# EasyEDA Pro project ProPrj_USB Connector_2025-08-25.epro

# Schematic Schematic1
Board Name: Board1; Create Date: 2025-08-16; Page Name: P1; Project Name: USB Connector; Schematic Name: Schematic1; Update Date: 2025-08-16; Company: EasyEDA.com; Page Size: A4; Version: V1.0
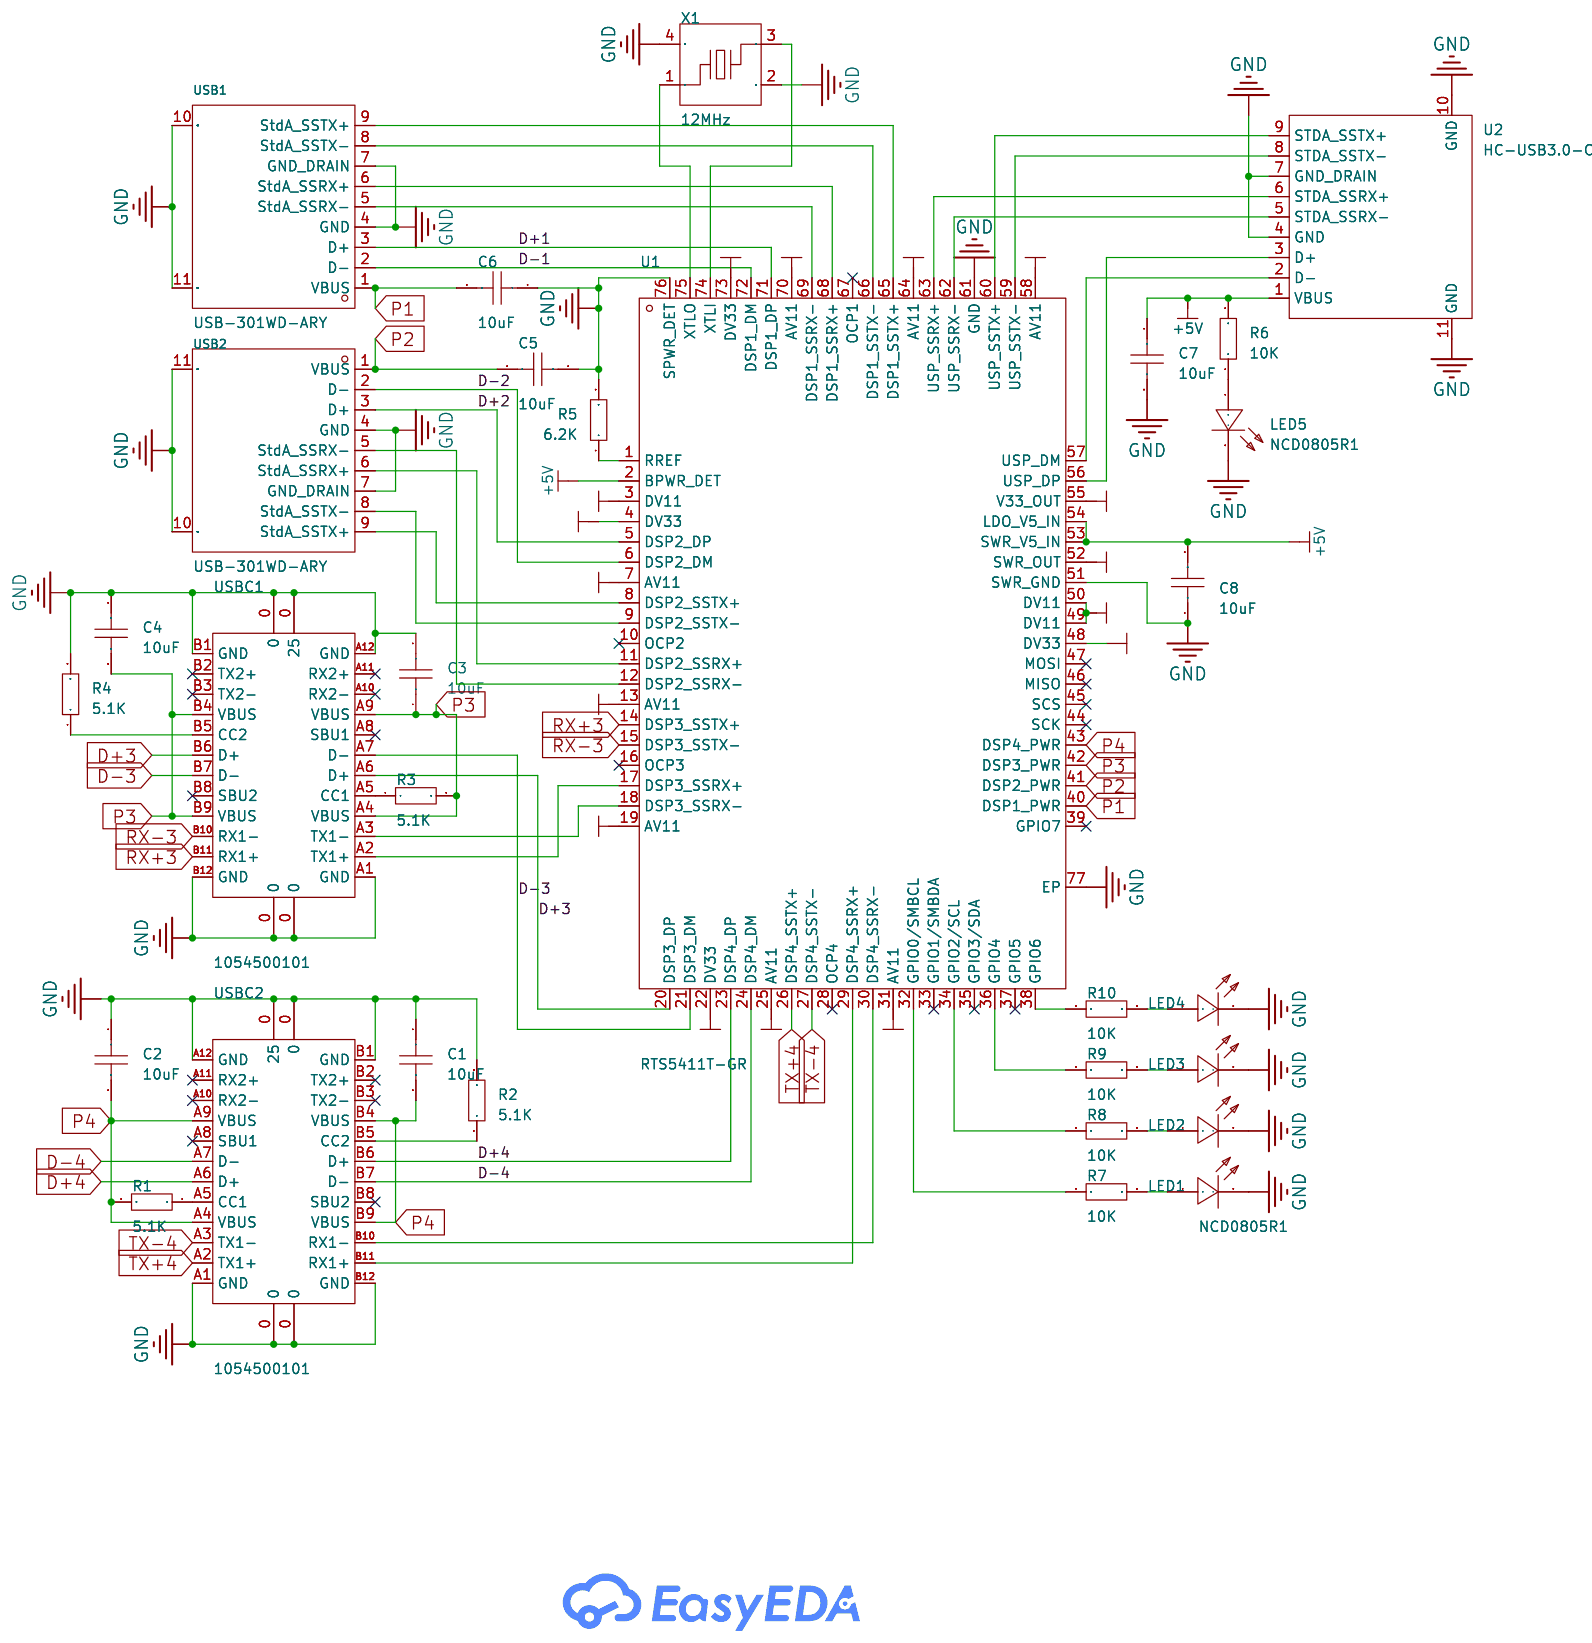
[diagram p0: schematic sheet]

## Parts
C1  10uF  [C0603]
C2  10uF  [C0603]
C3  10uF  [C0603]
C4  10uF  [C0603]
C5  10uF  [C0603]
C6  10uF  [C0603]
C7  10uF  [C0603]
C8  10uF  [C0603]
LED1  NCD0805R1  [LED0805-R-RD]
LED2  NCD0805R1  [LED0805-R-RD]
LED3  NCD0805R1  [LED0805-R-RD]
LED4  NCD0805R1  [LED0805-R-RD]
LED5  NCD0805R1  [LED0805-R-RD]
R1  5.1K  [R0603]
R2  5.1K  [R0603]
R3  5.1K  [R0603]
R4  5.1K  [R0603]
R5  6.2K  [R0603]
R6  10K  [R0603]
R7  10K  [R0603]
R8  10K  [R0603]
R9  10K  [R0603]
R10  10K  [R0603]
U1  RTS5411T-GR  [QFN-76_L9.0-W9.0-P0.40-BL-EP5.4]
U2  HC-USB3.0-C26  [USB-3.0-A-SMD_HC-USB3.0-C26]
USB1  USB-301WD-ARY  [USB-TH_XUNPU_USB-301WD-ARY]
USB2  USB-301WD-ARY  [USB-TH_XUNPU_USB-301WD-ARY]
USBC1  1054500101  [USB-C-SMD_TYPE-C-USB-18]
USBC2  1054500101  [USB-C-SMD_TYPE-C-USB-18]
X1  12MHz  [CRYSTAL-SMD_4P-L3.2-W2.5-BL-1]

## Library data of the parts
C1-C8 = CAP_0603: Supplier Footprint: 0603
LED1-LED5 = NCD0805R1_C84256: Lamp Holder Type:- Emitted Color:Red Forward Voltage (VF):1.6V~2.6V Forward Voltage (VF):1.6V~2.6V Power Dissipation:65mW Forward Current:20mA Dominant Wavelength:615nm~630nm Dominant Wavelength:615nm~630nm Peak Wavelength:- Diode Configuration:独立二极管 Lens; Supplier Part: C84256; Manufacturer: 国星光电; Supplier Footprint: 0805; JLCPCB Part Class: Basic Part; Datasheet: https://atta.szlcsc.com/upload/public/pdf/source/20200820/C84256_F0A75A43B3EAD75808600A0514C76B99.pdf; Supplier: LCSC; Emitted Color: Red; Forward Voltage (VF): 1.6V~2.6V; Power Dissipation: 65mW; Forward Current: 20mA; Dominant Wavelength: 615nm~630nm; Diode Configuration: 独立二极管; Lens Color: 无色透明透镜; Luminous Intensity: 67mcd~195mcd; Viewing Angle: 130°; Operating Temperature: -30℃~+85℃
R1-R10 = Res_0603: Supplier Footprint: 0603
U1 = RTS5411T-GR: type:Hub USB Protocol:USB 3.2 Voltage - Supply:3.3V；1.1V Voltage - Supply:3.3V；1.1V Operating Temperature:0℃~+70℃ Operating Temperature:0℃~+70℃; LCSC Part Name: RTS5411T USB3.2 Gen1x1 超高速 USB 集线器控制器; Supplier Part: C5159024; Manufacturer: REALTEK(瑞昱); Supplier Footprint: QFN-76(9x9); JLCPCB Part Class: Extended Part; Datasheet: https://atta.szlcsc.com/upload/public/pdf/source/20240319/5D12B3C0D31F8AE4B5F4A601072DAD0E.pdf; Supplier: LCSC; type: Hub; USB Protocol: USB 3.2; Voltage - Supply: 3.3V；1.1V; Operating Temperature: 0℃~+70℃
U2 = HC-USB3.0-C26: Connector Type:Type-A Protocol Standard:USB 3.0 Gender:Male Mounting Type:Sink panel Number of Contacts:9P Number of Ports:1 Current Rating-Power:1.5A Voltage Rating:30V Connect-Disconnect Life:1,500 times Supplementary Features:- Center Height:- Length:1; LCSC Part Name: Type-A 公 沉板 USB3.0 A公沉板2.6 直脚中针蓝色 无柱; Supplier Part: C7501854; Manufacturer: HC(虹成电子); Supplier Footprint: SMD; JLCPCB Part Class: Extended Part; Datasheet: https://atta.szlcsc.com/upload/public/pdf/source/20250106/ED41B030890D143B0E8E397973BB91FB.pdf; Supplier: LCSC; Connector Type: Type-A; Protocol Standard: USB 3.0; Gender: Male; Mounting Type: Sink panel; Number of Contacts: 9P; Number of Ports: 1; Current Rating-Power: 1.5A; Voltage Rating: 30V; Connect-Disconnect Life: 1,500 times; Length: 18.9mm; Detection color: Blue; Operating Temperature: -25℃~+70℃
USB1 USB2 = USB-301WD-ARY: Connector Type:Type-A Standard:USB 3.0 Gender:Female Number of Ports:1 Number of Contacts:9P Mounting Style:Right-Angle Current Rating - Power (Max):1.8A Contact Material:- Contact Plating:- Operating Temperature Range:-55℃~+85℃ Operating Temperature Rang; LCSC Part Name: Type-A 母 弯插; Supplier Part: C2895025; Manufacturer: XUNPU(讯普); Supplier Footprint: 插件; JLCPCB Part Class: Extended Part; Datasheet: https://atta.szlcsc.com/upload/public/pdf/source/20210908/6BA804621BB79CD49F2A1A281A5A9824.pdf; Supplier: LCSC; Connector Type: Type-A; Standard: USB 3.0; Gender: Female; Number of Ports: 1; Number of Contacts: 9P; Mounting Style: Right-Angle; Current Rating - Power (Max): 1.8A; Operating Temperature Range: -55℃~+85℃; Soldering Temperature(Max): 260℃
USBC1 USBC2 = 1054500101: Connector Type:Type-C Protocol Standard:USB 3.2 Gender:Female Number of Contacts:24P Number of Ports:1 Current Rating-Power:- Operating Temperature:-30℃~+85℃ Operating Temperature:-30℃~+85℃; LCSC Part Name: Type-C 母; Supplier Part: C134092; Manufacturer: MOLEX; Supplier Footprint: SMD; JLCPCB Part Class: Extended Part; Datasheet: https://www.molex.com/content/dam/molex/molex-dot-com/products/automated/en-us/salesdrawingpdf/105/105450/1054500101_sd.pdf?inline\; Supplier: LCSC; Connector Type: Type-C; Protocol Standard: USB 3.2; Gender: Female; Number of Contacts: 24P; Number of Ports: 1; Operating Temperature: -30℃~+85℃
X1 = XL2EL89COI-111YLC-12M: Type:Crystal Oscillator Frequency:12MHz Normal temperature Frequency Tolerance:±10ppm Normal temperature Frequency Tolerance:±10ppm Load Capacitance:12pF Frequency Stability:±20ppm Frequency Stability:±20ppm Operating Temperature:-40℃~+85℃ Operating Tempe; LCSC Part Name: YSX321SL 12MHZ 4P 3225 12PF ±10PPM -40~85℃ (±20PPM); Supplier Part: C5280578; Manufacturer: YXC(扬兴晶振); Supplier Footprint: SMD3225-4P; JLCPCB Part Class: Extended Part; Datasheet: https://item.szlcsc.com/datasheet/XL2EL89COI-111YLC-12M/6016760.html; Supplier: LCSC; Type: Crystal Oscillator; Normal temperature Frequency Tolerance: ±10ppm; Load Capacitance: 12pF; Frequency Stability: ±20ppm; Operating Temperature: -40℃~+85℃

## Nets
+1V1: U1.3(DV11) U1.7(AV11) U1.13(AV11) U1.19(AV11) U1.25(AV11) U1.31(AV11) U1.49(DV11) U1.50(DV11) U1.52(SWR_OUT) U1.58(AV11) U1.64(AV11) U1.70(AV11)
+3V3: U1.4(DV33) U1.22(DV33) U1.48(DV33) U1.55(V33_OUT) U1.73(DV33)
+5V: C7.1 C8.2 R6.2 U1.2(BPWR_DET) U1.53(SWR_V5_IN) U1.54(LDO_V5_IN) U2.1(VBUS)
GND: C1.1 C2.1 C3.2 C4.1 C5.1 C6.1 C7.2 C8.1 LED1.2(-) LED2.2(-) LED3.2(-) LED4.2(-) LED5.2(-) R2.2 R4.2 R5.2 U1.51(SWR_GND) U1.61(GND) U1.76(SPWR_DET) U1.77(EP) U2.4(GND) U2.7(GND_DRAIN) U2.10(GND) U2.11(GND) USB1.4(GND) USB1.7(GND_DRAIN) USB1.10(SHIELD) USB1.11(SHIELD) USB2.4(GND) USB2.7(GND_DRAIN) USB2.10(SHIELD) USB2.11(SHIELD) USBC1.0 USBC1.A1(GND) USBC1.A12(GND) USBC1.B1(GND) USBC1.B12(GND) USBC2.0 USBC2.A1(GND) USBC2.A12(GND) USBC2.B1(GND) USBC2.B12(GND) X1.2(GND) X1.4(GND)
D+1: U1.71(DSP1_DP) USB1.3(D+)
D+2: U1.5(DSP2_DP) USB2.3(D+)
D+3: U1.20(DSP3_DP) USBC1.A6(D+) USBC1.B6(D+)
D+4: U1.23(DSP4_DP) USBC2.A6(D+) USBC2.B6(D+)
D-1: U1.72(DSP1_DM) USB1.2(D-)
D-2: U1.6(DSP2_DM) USB2.2(D-)
D-3: U1.21(DSP3_DM) USBC1.A7(D-) USBC1.B7(D-)
D-4: U1.24(DSP4_DM) USBC2.A7(D-) USBC2.B7(D-)
P1: C6.2 U1.40(DSP1_PWR) USB1.1(VBUS)
P2: C5.2 U1.41(DSP2_PWR) USB2.1(VBUS)
P3: C3.1 C4.2 R3.2 U1.42(DSP3_PWR) USBC1.A4(VBUS) USBC1.A9(VBUS) USBC1.B4(VBUS) USBC1.B9(VBUS)
P4: C1.2 C2.2 R1.2 U1.43(DSP4_PWR) USBC2.A4(VBUS) USBC2.A9(VBUS) USBC2.B4(VBUS) USBC2.B9(VBUS)
RX+3: U1.14(DSP3_SSTX+) USBC1.B11(RX1+)
RX-3: U1.15(DSP3_SSTX-) USBC1.B10(RX1-)
TX+4: U1.26(DSP4_SSTX+) USBC2.A2(TX1+)
TX-4: U1.27(DSP4_SSTX-) USBC2.A3(TX1-)
$1N3590: U1.12(DSP2_SSRX-) USB2.5(StdA_SSRX-)
$1N3596: U1.11(DSP2_SSRX+) USB2.6(StdA_SSRX+)
$1N3603: U1.8(DSP2_SSTX+) USB2.9(StdA_SSTX+)
$1N3610: U1.9(DSP2_SSTX-) USB2.8(StdA_SSTX-)
$1N3617: U1.65(DSP1_SSTX+) USB1.9(StdA_SSTX+)
$1N3622: U1.66(DSP1_SSTX-) USB1.8(StdA_SSTX-)
$1N3628: U1.69(DSP1_SSRX-) USB1.5(StdA_SSRX-)
$1N3637: U1.68(DSP1_SSRX+) USB1.6(StdA_SSRX+)
$1N3848: U1.29(DSP4_SSRX+) USBC2.B11(RX1+)
$1N3853: U1.30(DSP4_SSRX-) USBC2.B10(RX1-)
$1N3939: R1.1 USBC2.A5(CC1)
$1N3974: R2.1 USBC2.B5(CC2)
$1N3996: U1.18(DSP3_SSRX-) USBC1.A3(TX1-)
$1N4002: U1.17(DSP3_SSRX+) USBC1.A2(TX1+)
$1N4082: R3.1 USBC1.A5(CC1)
$1N4114: R4.1 USBC1.B5(CC2)
$1N4604: U1.59(USP_SSTX-) U2.8(STDA_SSTX-)
$1N4609: U1.60(USP_SSTX+) U2.9(STDA_SSTX+)
$1N4615: U1.62(USP_SSRX-) U2.5(STDA_SSRX-)
$1N4620: U1.63(USP_SSRX+) U2.6(STDA_SSRX+)
$1N4626: U1.57(USP_DM) U2.2(D-)
$1N4632: U1.56(USP_DP) U2.3(D+)
$1N5187: R5.1 U1.1(RREF)
$1N5405: U1.75(XTLO) X1.1
$1N5413: U1.74(XTLI) X1.3
$1N5825: R10.1 U1.38(GPIO6)
$1N5829: R9.1 U1.36(GPIO4)
$1N5835: R8.1 U1.34(GPIO2/SCL)
$1N5841: R7.1 U1.32(GPIO0/SMBCL)
$1N5974: LED5.1(+) R6.1
$1N6057: LED1.1(+) R7.2
$1N6084: LED2.1(+) R8.2
$1N6111: LED3.1(+) R9.2
$1N6138: LED4.1(+) R10.2

Not connected (* = marked no-connect by the designer): U1 10(OCP2)* 16(OCP3)* 28(OCP4)* 33(GPIO1/SMBDA)* 35(GPIO3/SDA)* 37(GPIO5)* 39(GPIO7)* 44(SCK)* 45(SCS)* 46(MISO)* 47(MOSI)* 67(OCP1)*; USBC1 A8(SBU1)* A10(RX2-)* A11(RX2+)* B2(TX2+)* B3(TX2-)* B8(SBU2)*; USBC2 A8(SBU1)* A10(RX2-)* A11(RX2+)* B2(TX2+)* B3(TX2-)* B8(SBU2)*

# Board PCB1
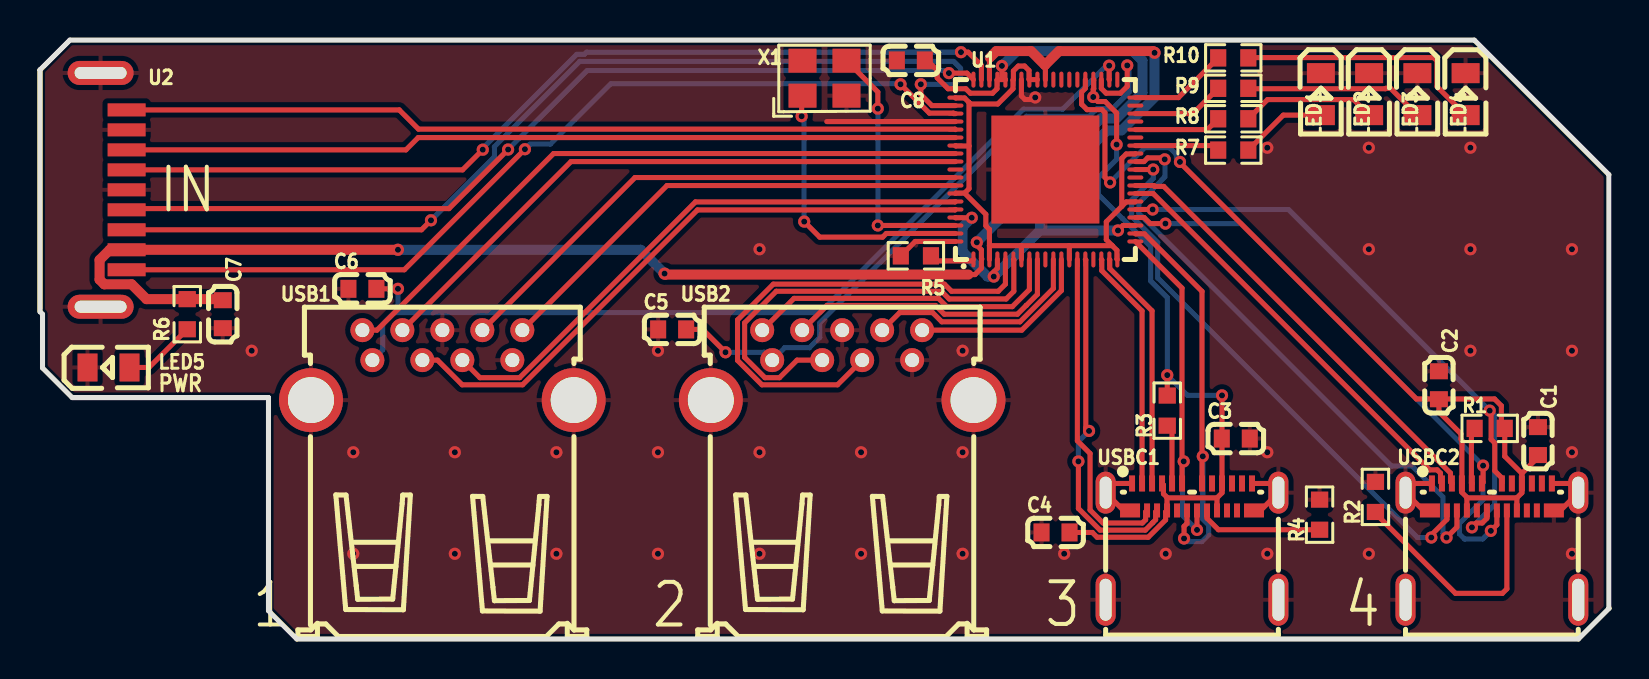
[diagram p1: board, top side]
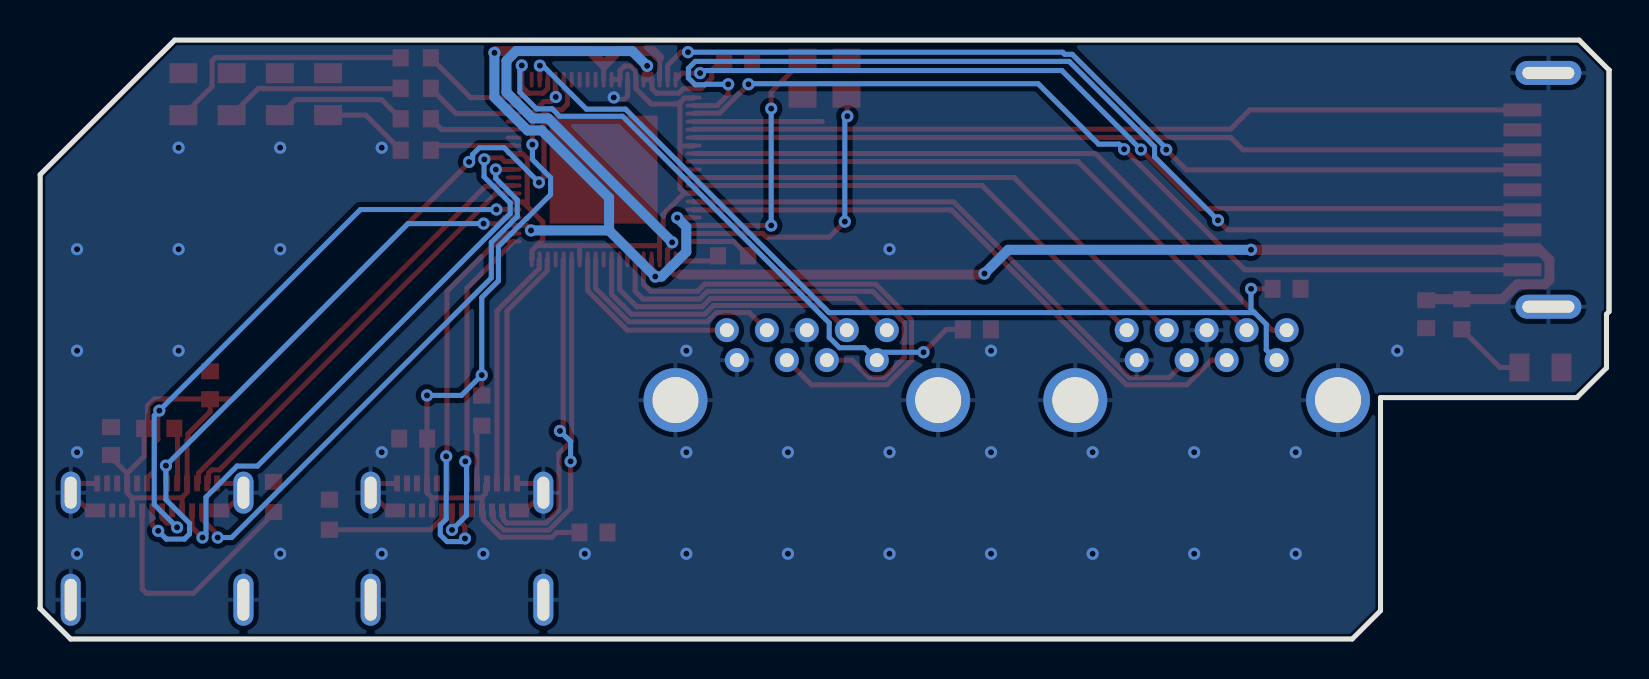
[diagram p2: board, bottom side, seen from below]

Outline 78.49 x 29.97 mm; copper layers: Top Layer, Bottom Layer. Coordinates in mm from the lower left corner of the outline.
Outline path: 0,28.48 1.49,29.97 71.74,29.97 78.48,23.24 78.48,1.53 78.49,1.53 76.95,0 12.85,0 11.43,1.42 11.43,12.08 1.61,12.08 0.13,13.57 0.13,16.26 0,16.38 0,28.48
Stack: Top Layer 0.035mm / Dielectric1 1.51mm FR4 er 4.5 / Bottom Layer 0.035mm

## Design rules (mm)
template: JLCPCB Capability(Two Layers Board)
spacing copperThickness1oz (default): track to track 0.102, other pairs 0.152 to 0.3
spacing copperThickness2oz: track to track 0.203, other pairs 0.152 to 0.3
track width copperThickness1oz (default): min 0.127, default 0.254, max 2.54
track width copperThickness2oz: min 0.203, default 0.254, max 2.54
differential pair differentialPair (default): width min 0.127, default 0.254, max 2.54; gap min 0.152, default 0.152
via viaSize (default): diameter min 0.5, default 0.61, max 10; hole min 0.3, default 0.305, max 6.3

## Placement (name value [footprint] x y rotation side)
C1  10uF  [C0603]  74.93 9.91 270 top
C2  10uF  [C0603]  69.98 12.7 270 top
C3  10uF  [C0603]  59.82 10.03 0 top
C4  10uF  [C0603]  50.8 5.33 0 top
C5  10uF  [C0603]  31.62 15.49 0 top
C6  10uF  [C0603]  16.13 17.53 0 top
C7  10uF  [C0603]  9.14 16.26 270 top
C8  10uF  [C0603]  43.56 28.96 0 top
LED1  NCD0805R1  [LED0805-R-RD]  64.07 27.27 270 top
LED2  NCD0805R1  [LED0805-R-RD]  66.49 27.27 270 top
LED3  NCD0805R1  [LED0805-R-RD]  68.9 27.27 270 top
LED4  NCD0805R1  [LED0805-R-RD]  71.31 27.27 270 top
LED5  NCD0805R1  [LED0805-R-RD]  3.43 13.59 0 top
R1  5.1K  [R0603]  72.52 10.54 0 top
R2  5.1K  [R0603]  66.8 7.11 90 top
R3  5.1K  [R0603]  56.39 11.43 90 top
R4  5.1K  [R0603]  64.01 6.22 90 top
R5  6.2K  [R0603]  43.81 19.18 180 top
R6  10K  [R0603]  7.37 16.26 90 top
R7  10K  [R0603]  59.69 24.47 0 top
R8  10K  [R0603]  59.69 26.03 0 top
R9  10K  [R0603]  59.69 27.56 0 top
R10  10K  [R0603]  59.69 29.08 0 top
U1  RTS5411T-GR  [QFN-76_L9.0-W9.0-P0.40-BL-EP5.4]  50.29 23.5 0 top
U2  HC-USB3.0-C26  [USB-3.0-A-SMD_HC-USB3.0-C26]  3.68 22.48 270 top
USB1  USB-301WD-ARY  [USB-TH_XUNPU_USB-301WD-ARY]  20.13 13.71 0 top
USB2  USB-301WD-ARY  [USB-TH_XUNPU_USB-301WD-ARY]  40.13 13.71 0 top
USBC1  1054500101  [USB-C-SMD_TYPE-C-USB-18]  57.63 4.88 0 top
USBC2  1054500101  [USB-C-SMD_TYPE-C-USB-18]  72.63 4.88 0 top
X1  12MHz  [CRYSTAL-SMD_4P-L3.2-W2.5-BL-1]  39.24 28.07 0 top

## Footprints (pads in the part's own frame, mm; a bottom-side part is the same pattern mirrored in y, then rotated)
C0603
  rect 0.8x0.9 smd: 1(-0.7,0) 2(0.7,0)
CRYSTAL-SMD_4P-L3.2-W2.5-BL-1
  rect 1.4x1.2 smd: 1(-1.1,-0.875) 2(1.1,-0.875) 3(1.1,0.875) 4(-1.1,0.875)
LED0805-R-RD
  rect 1x1.399 smd: 1(1.05,0) 2(-1.05,0)
QFN-76_L9.0-W9.0-P0.40-BL-EP5.4
  oval 0.2x0.8 smd: 1(-3.599,-4.5) 2(-3.2,-4.5) 3(-2.799,-4.5) 4(-2.401,-4.5) 5(-1.999,-4.5) 6(-1.6,-4.5) 7(-1.199,-4.5) 8(-0.8,-4.5) 9(-0.399,-4.5) 10(0,-4.5) 11(0.399,-4.5) 12(0.8,-4.5) 13(1.199,-4.5) 14(1.6,-4.5) 15(1.999,-4.5) 16(2.401,-4.5) 17(2.799,-4.5) 18(3.2,-4.5) 19(3.599,-4.5) 39(3.599,4.5) 40(3.2,4.5) 41(2.799,4.5) 42(2.401,4.5) 43(1.999,4.5) 44(1.6,4.5) 45(1.199,4.5) 46(0.8,4.5) 47(0.399,4.5) 48(0,4.5) 49(-0.399,4.5) 50(-0.8,4.5) 51(-1.199,4.5) 52(-1.6,4.5) 53(-1.999,4.5) 54(-2.401,4.5) 55(-2.799,4.5) 56(-3.2,4.5) 57(-3.599,4.5)
  oval 0.8x0.2 smd: 20(4.5,-3.599) 21(4.5,-3.2) 22(4.5,-2.799) 23(4.5,-2.401) 24(4.5,-1.999) 25(4.5,-1.6) 26(4.5,-1.199) 27(4.5,-0.8) 28(4.5,-0.399) 29(4.5,0) 30(4.5,0.399) 31(4.5,0.8) 32(4.5,1.199) 33(4.5,1.6) 34(4.5,1.999) 35(4.5,2.401) 36(4.5,2.799) 37(4.5,3.2) 38(4.5,3.599) 58(-4.5,3.599) 59(-4.5,3.2) 60(-4.5,2.799) 61(-4.5,2.401) 62(-4.5,1.999) 63(-4.5,1.6) 64(-4.5,1.199) 65(-4.5,0.8) 66(-4.5,0.399) 67(-4.5,0) 68(-4.5,-0.399) 69(-4.5,-0.8) 70(-4.5,-1.199) 71(-4.5,-1.6) 72(-4.5,-1.999) 73(-4.5,-2.401) 74(-4.5,-2.799) 75(-4.5,-3.2) 76(-4.5,-3.599)
  rect 5.4x5.4 smd: 77(0,0)
R0603
  rect 0.806x0.864 smd: 1(-0.753,0) 2(0.753,0)
USB-3.0-A-SMD_HC-USB3.0-C26
  rect 0.65x1.9 smd: 1(3,0.65) 2(1,0.65) 3(-1,0.65) 4(-3,0.65) 5(-4,0.65) 6(-2,0.65) 7(0,0.65) 8(2,0.65) 9(4,0.65)
  oval 1.2x3.3 hole 0.6x2.6: 10(-5.85,-0.65) 11(5.85,-0.65)
USB-C-SMD_TYPE-C-USB-18
  oval 1x2.1 hole 0.6x1.6: 0(-4.32,2.45) 0(4.32,2.45)
  oval 1x2.6 hole 0.6x2.1: 0(-4.32,-2.91) 0(4.32,-2.91)
  rect 0.3x0.8 smd: A1(-3,2.91) A2(-2.5,2.91) A3(-2,2.91) A4(-1.5,2.91) A5(-1,2.91) A6(-0.5,2.91) A7(0.5,2.91) A8(1,2.91) A9(1.5,2.91) A10(2,2.91) A11(2.5,2.91) A12(3,2.91)
  rect 1x0.7 smd: B1(3.1,1.56) B12(-3.1,1.56)
  rect 0.3x0.7 smd: B2(2.25,1.56) B3(1.75,1.56) B4(1.25,1.56) B5(0.75,1.56) B6(0.25,1.56) B7(-0.25,1.56) B8(-0.75,1.56) B9(-1.25,1.56) B10(-1.75,1.56) B11(-2.25,1.56)
USB-TH_XUNPU_USB-301WD-ARY
  round 1.2 hole 0.7: 1(-3.5,0.25) 2(-1,0.25) 3(1,0.25) 4(3.5,0.25) 5(4,1.75) 6(2,1.75) 7(0,1.75) 8(-2,1.75) 9(-4,1.75)
  round 3.2 hole 2.3: 10(-6.57,-1.75) 11(6.57,-1.75)

## Nets
As in the schematic.

Pads without a net: U1 10 16 28 33 35 37 39 44 45 46 47 67; USBC1 A8 A10 A11 B2 B3 B8; USBC2 A8 A10 A11 B2 B3 B8

## Via types
v1: diameter 0.61, hole 0.305, Top Layer to Bottom Layer, 80 vias

## Routing (per net, layer and track width the routed paths; a pad name or vN(x,y) marks a point on that pad's centre or on a via; arc(x,y) is an arc through that point)
+1V1: length 30.4
  Top Layer w0.254: 54.12,21.66 53.34,20.88 53.34,19.98 53.64,19.68 ; 54.12,21.66 54.11,21.66 54.11,24.05 54.33,24.27 54.77,24.27 U1.31 ; 54.12,21.66 54.33,21.88 54.77,21.88 U1.25 ; 53.64,19.68 51.47,19.68 ; 53.64,19.68 53.87,19.45 53.87,19.02 U1.19 ; 51.47,19.68 51.49,19.66 U1.13 ; 51.47,19.68 49.07,19.68 ; U1.49 U1.50 49.47,28.01 49.47,28.45 49.25,28.67 48.94,28.67 48.69,28.43 U1.52 48.67,27.97 48.67,27.54 47.91,26.78 46.55,26.78 46.47,26.85 ; 49.07,19.68 49.09,19.66 U1.7 ; 49.07,19.68 47.49,19.68 ; 46.25,22.32 46.47,22.54 46.47,24.67 ; 46.25,22.32 45.81,22.32 U1.70 ; 46.25,22.32 47.31,21.25 47.31,20.68 47.49,20.5 47.49,19.68 ; 47.49,19.68 U1.3 ; U1.64 45.81,24.67 46.47,24.67 ; 46.47,26.85 46.25,27.07 45.81,27.07 U1.58 ; 46.47,26.85 46.47,24.67
+3V3: length 36.3
  Top Layer w0.254: U1.73 45.81,21.08 v1(46.61,21.08) ; U1.55 47.49,29.08 ; U1.22 54.17,20.7 v1(53.92,20.45) ; U1.48 50.29,28.7 ; U1.4 47.89,18.55 47.71,18.37 v1(47.71,18.14)
  Top Layer w0.5: v1(55.75,29.34) 55.67,29.42 50.97,29.42 50.27,28.72 49.57,29.42 47.84,29.42 47.51,29.1
  Bottom Layer w0.5: 50.02,20.45 50.02,22.08 53.39,25.45 54.09,25.45 55.75,27.11 v1(55.75,29.34) ; 50.02,20.45 v1(53.92,20.45) ; 50.02,20.45 v1(47.71,18.14) 47.39,18.14 46.16,19.38 46.16,20.63 v1(46.61,21.08)
+5V: length 80.7
  Top Layer w0.254: U1.2 47.09,18.56 46.77,18.24 46.44,18.24 ; 47.11,19.02 47.09,19.04 47.09,19.47 46.86,19.7 v1(46.86,19.85) ; C8.2 44.39,28.96 44.88,28.46 44.88,28.08 45.42,27.54 46.31,27.54 46.54,27.32 47.65,27.32 47.87,27.54 47.87,27.97 U1.54 U1.53 48.12,28.17 v1(48.12,28.68)
  Top Layer w0.5: v1(17.91,19.48) U2.1 3.49,19.48 2.98,18.97 2.98,17.99 3.22,17.75 4.59,17.75 5.33,17.01 R6.2 9.09,17.01 C7.1 ; v1(31.24,18.29) 31.29,18.24 46.44,18.24
  Bottom Layer w0.5: v1(31.24,18.29) 30.05,19.48 v1(17.91,19.48) ; v1(48.12,28.68) 48.86,29.42 54.67,29.42 55.15,28.94 55.15,27.36 53.85,26.05 53.06,26.05 v1(46.86,19.85)
GND: length 23.4
  Top Layer w0.254: USBC2.A12 76.49,7.79 USBC2.0 76.06,6.44 USBC2.B1 ; 49.78,27 49.27,27 49.09,27.18 U1.51 ; USBC1.B12 54.2,6.44 USBC1.0 53.77,7.79 USBC1.A1 ; USBC2.A1 68.77,7.79 USBC2.0 69.2,6.44 USBC2.B12 ; U1.76 43.78,19.9 R5.2 ; USBC1.A12 61.49,7.79 USBC1.0 61.06,6.44 USBC1.B1 ; U1.61 39.36,25.9
  vias: v1(10.59,14.43) v1(15.67,9.35) v1(15.67,4.27) v1(20.75,9.35) v1(20.75,4.27) v1(25.83,9.35) v1(25.83,4.27) v1(30.91,14.43) v1(30.91,9.35) v1(30.91,4.27) v1(35.99,19.51) v1(35.99,9.35) v1(35.99,4.27) v1(41.07,9.35) v1(41.07,4.27) v1(46.15,14.43) v1(46.15,9.35) v1(46.15,4.27) v1(49.78,27.1) v1(51.23,4.27) v1(56.31,4.27) v1(61.39,24.59) v1(61.39,9.35) v1(61.39,4.27) v1(66.47,24.59) v1(66.47,19.51) v1(66.47,4.27) v1(71.55,24.59) v1(71.55,19.51) v1(71.55,14.43) v1(76.63,19.51) v1(76.63,14.43) v1(76.63,9.35) v1(76.63,4.27)
D+1: length 28.7
  Top Layer w0.254: U1.71 45.77,21.88 32.79,21.88 23.99,13.08 22.01,13.08 USB1.3
D+2: length 25
  Top Layer w0.254: USB2.3 39.89,12.72 36.12,12.72 34.89,13.95 34.89,15.97 36.68,17.76 45.24,17.76 45.6,17.4 47.94,17.4 48.29,17.76 U1.5
D+3: length 17.8
  Top Layer w0.254: U1.20 57.13,17.56 USBC1.A6 ; USBC1.B6 v1(57.88,5.46)
  Bottom Layer w0.254: v1(57.88,5.46) 57.15,6.19 57.15,8.89
  vias: v1(57.21,8.89)
D+4: length 30.4
  Top Layer w0.254: v1(56.3,20.79) 55.53,20.79 55.23,21.09 U1.23 ; USBC2.B6 72.88,5.72 v1(72.58,5.41) ; USBC2.A6 72.19,7.84 v1(72.19,8.68)
  Bottom Layer w0.254: v1(72.58,5.41) 72.17,5 71.26,5 71,5.26 71,5.79 72.19,6.97 v1(72.19,8.68) 60.08,20.79 v1(56.3,20.79)
D-1: length 30.8
  Top Layer w0.254: USB1.2 19.88,13.96 21.12,12.72 24.14,12.72 32.89,21.47 45.77,21.47 U1.72
D-2: length 22.4
  Top Layer w0.254: USB2.2 37.87,13.96 36.99,13.08 36.26,13.08 35.25,14.09 35.25,15.82 36.83,17.4 45.09,17.4 45.48,17.02 48.33,17.02 48.71,17.4 48.71,18.97 U1.6
D-3: length 21.1
  Top Layer w0.254: U1.21 54.81,20.28 55.25,20.28 58.13,17.4 USBC1.A7 ; v1(57.23,5.03) 57.23,5.64 57.38,5.79 USBC1.B7
  Bottom Layer w0.254: v1(57.23,5.03) 57.38,4.88 58.12,4.88 58.46,5.22 58.46,5.7 58.17,6 v1(58.17,9.14)
D-4: length 33.5
  Top Layer w0.254: 55.66,21.5 U1.24 ; USBC2.B7 72.38,6.04 72.14,5.81 71.85,5.81 v1(71.63,5.59) ; v1(72.52,11.43) 72.59,11.36 72.59,9.99 72.77,9.81 72.77,8.41 73.13,8.06 USBC2.A7
  Bottom Layer w0.254: v1(55.66,21.49) 62.45,21.49 v1(72.52,11.43) 72.77,11.18 72.77,6.73 v1(71.63,5.59)
P1: length 46.7
  Top Layer w0.254: v1(53.48,28.69) 53.48,28 U1.40 ; C6.2 v1(17.91,17.53)
  Bottom Layer w0.254: v1(53.48,28.69) 53.33,28.69 51.16,26.52 49.2,26.52 39.02,16.34 17.73,16.34 ; 17.73,16.34 17.15,15.75 17.15,14.47 USB1.1 ; 17.73,16.34 17.91,16.51 v1(17.91,17.53)
P2: length 33.2
  Top Layer w0.254: v1(34.29,14.35) 33.15,15.49 C5.2 ; v1(54.39,28.7) 54.39,27.65 54.05,27.32 53.33,27.32 53.09,27.55 U1.41
  Bottom Layer w0.254: v1(54.39,28.7) 54.48,28.61 54.48,27.37 53.65,26.53 52.87,26.53 52.5,26.16 49.35,26.16 39.01,15.82 39.01,15.09 38.49,14.58 37.25,14.58 USB2.1 36.23,14.35 v1(34.29,14.35)
P3: length 37.1
  Top Layer w0.254: 56.38,7.06 58.88,7.06 ; 56.38,7.06 USBC1.B9 56.31,6.36 56.31,5.96 55.44,5.09 52.88,5.09 52.64,5.33 C4.2 ; 56.38,7.06 56.38,7.09 56.2,7.27 56.2,7.71 USBC1.A4 ; 58.88,7.06 USBC1.B4 ; 58.88,7.06 59.13,7.31 USBC1.A9 v1(59.13,12.19) ; v1(53.86,24.74) 53.86,26.32 53.28,26.9 52.91,26.9 v1(52.69,27.13) 52.69,27.51 52.71,27.54 52.71,27.97 U1.42 ; v1(56.39,13.21) R3.2
  Bottom Layer w0.254: v1(59.13,12.19) 57.4,12.19 v1(56.39,13.21) 56.39,17.09 55.55,17.92 55.55,19.64 54.17,21.03 54.15,21.03 52.94,22.24 52.94,23.09 53.86,24 v1(53.86,24.74)
P4: length 47.7
  Top Layer w0.254: C2.2 69.98,11.37 71.08,10.26 71.08,9.99 71.13,9.95 USBC2.A4 71.12,7.78 71.12,7.35 71.38,7.09 71.38,7.06 ; 73.88,7.06 USBC2.B4 ; 73.88,7.06 71.38,7.06 ; 73.88,7.06 74.13,7.31 USBC2.A9 74.13,8.29 ; C1.2 74.93,9.09 74.13,8.29 ; v1(57.02,23.88) 57.02,23.84 68.85,12.01 72.76,12.01 73.1,11.67 73.1,10.71 R1.2 73.27,9.14 74.13,8.29 ; v1(53.53,22.85) 53.27,23.11 53.27,26.34 53.12,26.49 52.38,26.49 52.1,26.77 52.1,27.37 52.29,27.56 U1.43 ; USBC2.B9 71.38,7.06
  Bottom Layer w0.254: v1(53.53,22.85) 55.27,24.59 56.5,24.59 56.84,24.25 56.84,24.05 v1(57.02,23.88)
RX+3: length 16.4
  Top Layer w0.254: USBC1.B11 55.31,6.36 55.31,5.97 55.14,5.81 53.17,5.81 52.53,6.45 52.53,9.28 51.89,9.92 U1.14
RX-3: length 17.8
  Top Layer w0.254: v1(52.48,10.41) 52.31,10.58 52.31,18.97 U1.15 ; USBC1.B10 55.81,6.36 55.81,5.97 55.66,5.83 55.66,5.82 55.29,5.45 53.03,5.45 51.94,6.53 v1(51.94,8.89)
  Bottom Layer w0.254: v1(52.48,10.41) 51.94,9.88 v1(51.94,8.89)
TX+4: length 21.6
  Top Layer w0.254: USBC2.A2 70.06,7.86 70.06,8.3 69.89,8.46 69.51,8.46 55.68,22.3 U1.26
TX-4: length 22.3
  Top Layer w0.254: U1.27 55.72,22.69 55.76,22.65 56.21,22.65 70.56,8.3 70.56,7.86 USBC2.A3
$1N3590: length 9.3
  Top Layer w0.254: USB2.5 49.11,15.46 51.09,17.44 U1.12
$1N3596: length 11.3
  Top Layer w0.254: U1.11 50.69,17.54 49.02,15.88 45.11,15.88 44.65,16.34 43.01,16.34 USB2.6
$1N3603: length 16.1
  Top Layer w0.254: U1.8 49.49,17.49 48.64,16.63 45.36,16.63 44.95,17.05 37.72,17.05 USB2.9
$1N3610: length 14.6
  Top Layer w0.254: USB2.8 39.36,16.69 44.8,16.69 45.23,16.26 48.9,16.26 49.33,16.69 49.34,16.69 49.89,17.25 U1.9
$1N3617: length 33.3
  Top Layer w0.254: U1.65 25.69,24.3 16.85,15.46 USB1.9
$1N3622: length 31.2
  Top Layer w0.254: USB1.8 26.56,23.89 U1.66
$1N3628: length 24.7
  Top Layer w0.254: USB1.5 31.37,22.69 U1.69
$1N3637: length 26.8
  Top Layer w0.254: U1.68 29.77,23.1 USB1.6
$1N3848: length 28
  Top Layer w0.254: v1(55.69,23.5) U1.29 ; USBC2.B11 70.38,5.99 69.6,5.21 v1(69.6,5.08)
  Bottom Layer w0.254: v1(55.69,23.5) 55.69,23.05 54.61,21.97 54.61,21.15 55.91,19.85 55.91,18.07 68.9,5.08 v1(69.6,5.08)
$1N3853: length 29.6
  Top Layer w0.254: v1(56.26,24) 56.19,24.08 55.41,24.08 55.23,23.89 U1.30 ; v1(70.36,5.08) 70.88,5.6 USBC2.B10
  Bottom Layer w0.254: v1(56.26,24) 56.26,23.9 56.27,23.89 56.27,23.13 54.97,21.82 54.97,21.29 67.61,8.65 68.63,8.65 70.18,7.1 70.18,5.26 v1(70.36,5.08)
$1N3939: length 2.8
  Top Layer w0.254: USBC2.A5 71.6,7.81 71.6,10.38 R1.1
$1N3974: length 12.3
  Top Layer w0.254: USBC2.B5 73.38,2.51 73.15,2.29 70.81,2.29 66.8,6.29 R2.1
$1N3996: length 12.1
  Top Layer w0.254: U1.18 53.51,18.98 53.51,18.54 55.63,16.42 USBC1.A3
$1N4002: length 12.1
  Top Layer w0.254: USBC1.A2 55.13,16.42 53.11,18.43 53.11,18.97 U1.17
$1N4082: length 3
  Top Layer w0.254: R3.1 56.63,10.44 USBC1.A5
$1N4114: length 6.3
  Top Layer w0.254: USBC1.B5 58.38,6.04 58.95,5.47 R4.1
$1N4604: length 50.7
  Top Layer w0.254: v1(44.06,27.76) 44.06,27.25 44.62,26.7 U1.59 ; v1(19.56,20.95) 19.08,20.48 U2.8
  Bottom Layer w0.254: v1(19.56,20.95) 22.73,24.13 22.73,24.64 27,28.91 45.71,28.91 46.05,28.56 46.05,28.08 45.71,27.74 45.22,27.74 45.2,27.76 v1(44.06,27.76)
$1N4609: length 45.9
  Top Layer w0.254: v1(24.26,24.51) 18.23,18.48 U2.9 ; v1(43.05,27.76) 44.49,26.32 45.69,26.32 45.72,26.29 U1.60
  Bottom Layer w0.254: v1(24.26,24.51) 24.51,24.77 25.53,24.77 28.55,27.79 43.02,27.79 v1(43.05,27.76)
$1N4615: length 41.9
  Top Layer w0.254: U1.62 45.77,25.52 18.93,25.52 17.97,26.48 U2.5
$1N4620: length 41.7
  Top Layer w0.254: U1.63 18.92,25.09 18.31,24.48 U2.6
$1N4626: length 45.4
  Top Layer w0.254: U1.57 46.37,28.32 v1(45.47,28.32) ; v1(23.42,24.5) 20.46,21.54 4.39,21.54 U2.2
  Bottom Layer w0.254: v1(45.47,28.32) 45.34,28.45 27.37,28.45 v1(23.42,24.5)
$1N4632: length 46.2
  Top Layer w0.254: v1(22.15,24.49) 21.14,23.48 U2.3 ; v1(46.07,29.37) 46.43,29.37 47.09,28.71 U1.56
  Bottom Layer w0.254: v1(46.07,29.37) 27.34,29.37 27.23,29.26 26.85,29.26 22.15,24.56 v1(22.15,24.49)
$1N5187: length 1.9
  Top Layer w0.254: U1.1 46.62,18.92 44.82,18.92
$1N5405: length 14.3
  Top Layer w0.254: X1.1 38.1,27.15 v1(38.1,26.16) ; U1.75 42.33,20.29 42.15,20.11 39,20.11 v1(38.23,20.89)
  Bottom Layer w0.254: v1(38.23,20.89) 38.23,26.03 v1(38.1,26.16)
$1N5413: length 12.8
  Top Layer w0.254: U1.74 v1(41.91,20.7) ; v1(41.91,26.54) 41.91,27.38 X1.3
  Bottom Layer w0.254: v1(41.91,20.7) v1(41.91,26.54)
$1N5825: length 5
  Top Layer w0.254: U1.38 56.95,27.09 R10.1
$1N5829: length 4.7
  Top Layer w0.254: U1.36 57.67,26.29 R9.1
$1N5835: length 4.4
  Top Layer w0.254: U1.34 58.4,25.49 R8.1
$1N5841: length 4.2
  Top Layer w0.254: R7.1 58.71,24.69 U1.32
$1N5974: length 3.7
  Top Layer w0.254: R6.1 5.45,13.59 LED5.1
$1N6057: length 4.4
  Top Layer w0.254: LED1.1 62.19,26.22 R7.2
$1N6084: length 6.8
  Top Layer w0.254: R8.2 61.4,27 65.71,27 LED2.1
$1N6111: length 9
  Top Layer w0.254: LED3.1 67.56,27.56 67.32,27.56 67.3,27.54 60.46,27.54 R9.2
$1N6138: length 12.8
  Top Layer w0.254: LED4.1 69.88,27.65 69.88,28.93 69.72,29.1 60.46,29.1 R10.2

## Copper pours and planes (outline as drawn; the poured copper is in the pictures)
GND on Top Layer: 0.13,29.97 78.48,29.97 78.48,0 0.13,0
GND on Bottom Layer: 0.13,29.97 78.48,29.97 78.48,0 0.13,0

## Text on the board
Top Silkscreen Layer: PWR | IN | 1 | 2 | 3 | 4
